# Altium schematic sheet CAN.SchDoc
size B
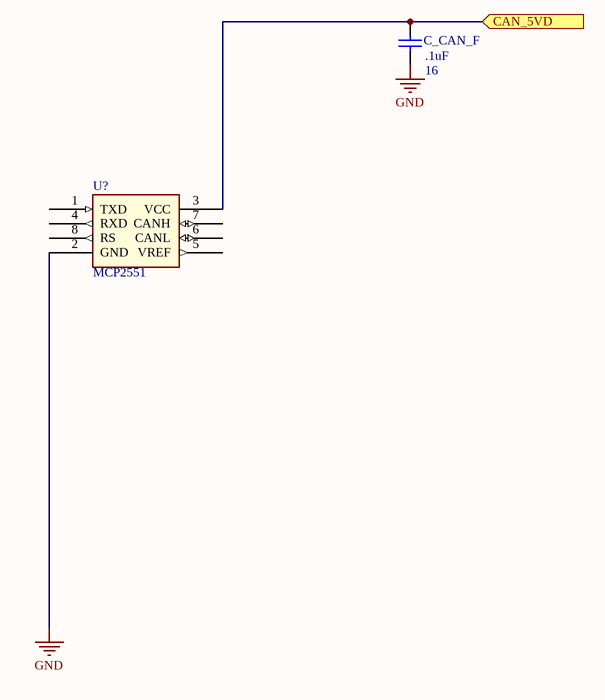
[diagram p0: CAN.SchDoc]

## Parts
C_CAN_F  value .1uF  WV: 16  [CAPC2012X09M]  (hidden comment: Cap)
U?  MCP2551  [SOIC127P600X175-8M]

## Ports
CAN_5VD (in)

## Nets
GND: C_CAN_F.1 U?.2(GND)
CAN_5VD: C_CAN_F.2 U?.3(VCC) ; port CAN_5VD

Not connected (* = marked no-connect by the designer): U? 1(TXD) 4(RXD) 5(VREF) 6(CANL) 7(CANH) 8(RS)

## Notes on the sheet
- ESE
- is the sole property of ESE. Any reproduction
- The Information Contained in this drawing
- Schematic P/N and Name
- Sheet Name
- 299 Doon Valley Drive
- Kitchener, ON N2G 4M4
- Canada
- Approved
- in part or in whole without the written
- permission of ESE is strictly prohibited.
- APPROVALS
- DATE
- Size
- Scale
- B
- NTS
- Bare PCB P/N
- Date
- Sheet
- Rev.
- Checked
- Engineer
- of

## Library data of the parts
C_CAN_F = CAP-X7R-.1uF-16V-±10%: CAP CER .1uF 16v X7R 0805; MPN: C0805C104K4RACTU; Tolerance: ±10%; PN: 399-1167-1-ND; Name: CAP-X7R-.1uF-16V-±10%; Type: X7R; URL: http://www.digikey.ca/product-detail/en/C0805C104K4RACTU/399-1167-1-ND
U? = MCP2551: IC TRANSCEIVER CAN HI-SPD 8-SOIC; MPN: MCP2551T-E/SN; PN: MCP2551T-E/SNCT-ND; URL: http://www.digikey.com/product-detail/en/MCP2551T-E%2FSN/MCP2551T-E%2FSNCT-ND